# EAGLE design FTDI ESP Programmer V1.0 (EAGLE 9.5.0)
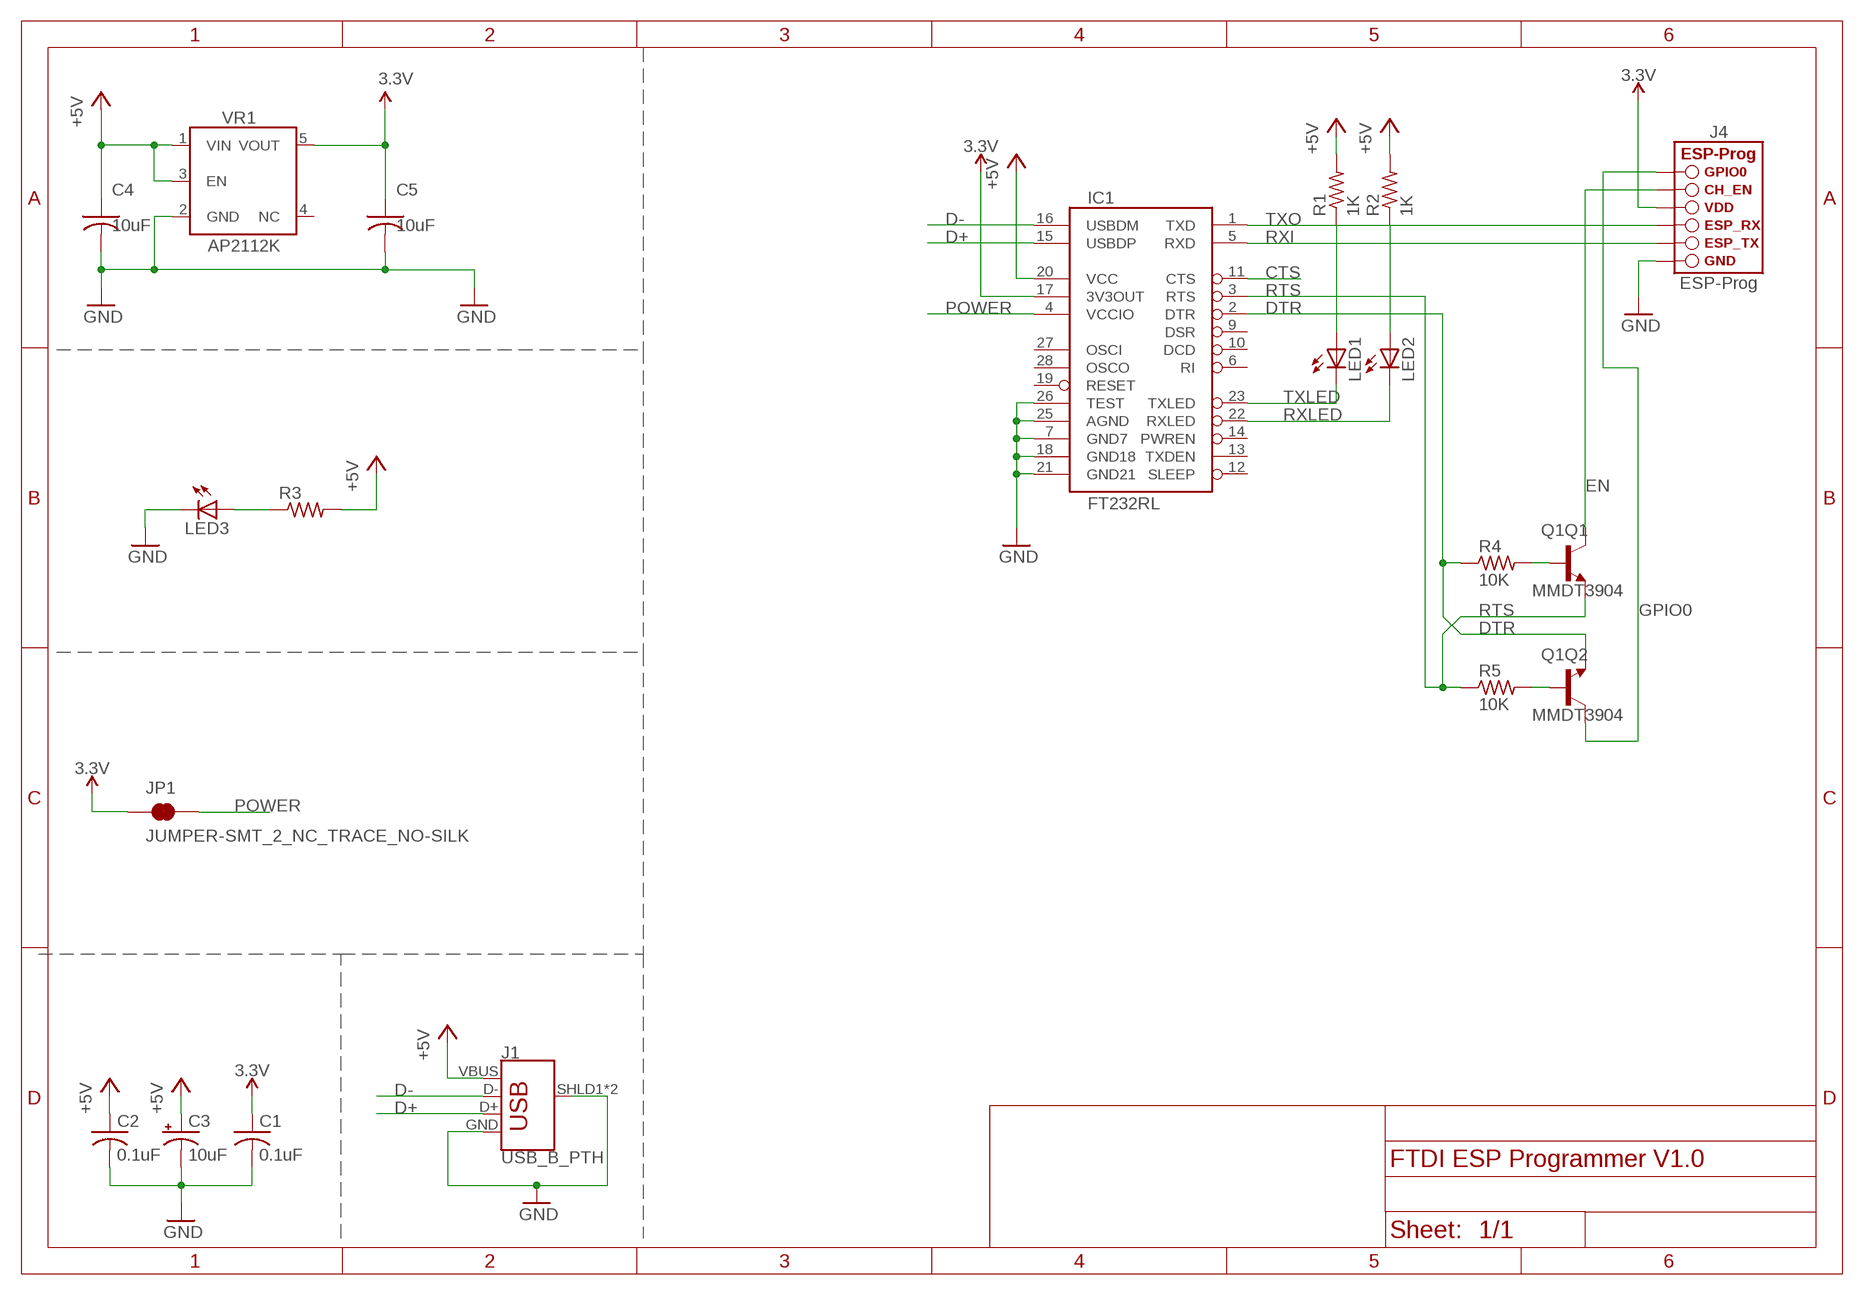
[diagram p0: schematic, sheet 1]

## Parts
C1  0.1uF  C-USC0603  [C0603]
C2  0.1uF  C-USC0603  [C0603]
C3  10uF  10UF-POLAR-EIA3216-16V-10%(TANT)  [EIA3216]
C4  10uF  C-USC0603  [C0603]
C5  10uF  C-USC0603  [C0603]
IC1  FT232RL  FT232RLSSOP  [SSOP28DB]
J1  USB_B_PTH  [USB-B-PTH]
J4  ESP-PROG-1X6-2.54-SOCKET-RA  [1X6-2.54-SOCKET-RA]
JP1  JUMPER-SMT_2_NC_TRACE_NO-SILK  [SMT-JUMPER_2_NC_TRACE_NO-SILK]
LED1  LEDCHIP-LED0805  [CHIP-LED0805]
LED2  LEDCHIP-LED0805  [CHIP-LED0805]
LED3  LEDCHIP-LED0805  [CHIP-LED0805]
Q1  MMDT3904  TRANS_NPN_DUAL-MMDT3904  [SOT-363]
R1  1K  R-US_R0603  [R0603]
R2  1K  R-US_R0603  [R0603]
R3  R-USR0603  [R0603@1]
R4  10K  R-USR0603  [R0603@1]
R5  10K  R-USR0603  [R0603@1]
VR1  AP2112KSOT25  [SOT23-5]

## Nets
3.3V: C1.1 C5.1 IC1.17(3V3OUT) J4.4(VDD) JP1.1 VR1.5(VOUT)
+5V: C2.1 C3.+ C4.1 IC1.20(VCC) J1.VBUS R1.2 R2.2 R3.2 VR1.1(VIN) VR1.3(EN)
CTS: IC1.11(CTS)
D+: IC1.15(USBDP) J1.D+
D-: IC1.16(USBDM) J1.D-
DTR: IC1.2(DTR) Q1.1(Q2:E) R4.1
EN: J4.5(CH_EN) Q1.3(Q1:C)
GND: C1.2 C2.2 C3.- C4.2 C5.2 IC1.7(GND7) IC1.18(GND18) IC1.21(GND21) IC1.25(AGND) IC1.26(TEST) J1.GND J1.SHLD1(SHIELD) J1.SHLD2(SHIELD) J4.1(GND) LED3.C VR1.2(GND)
GPIO0: J4.6(GPIO0) Q1.6(Q2:C)
N$1: LED1.A R1.1
N$2: LED3.A R3.1
N$4: LED2.A R2.1
N$7: Q1.5(Q1:B) R4.2
N$8: Q1.2(Q2:B) R5.2
POWER: IC1.4(VCCIO) JP1.2
RTS: IC1.3(RTS) Q1.4(Q1:E) R5.1
RXI: IC1.5(RXD) J4.2(ESP_TX)
RXLED: IC1.22(RXLED) LED2.C
TXLED: IC1.23(TXLED) LED1.C
TXO: IC1.1(TXD) J4.3(ESP_RX)
Unconnected: IC1.6(RI) IC1.9(DSR) IC1.10(DCD) IC1.12(SLEEP) IC1.13(TXDEN) IC1.14(PWREN) IC1.19(RESET) IC1.27(OSCI) IC1.28(OSCO) VR1.4(NC)

## Library data of the parts
C1 C2 C4 C5 = Dennistries-Josh:C-US: CAPACITOR, American symbol
C3 = Dennistries-Josh:10UF-POLAR: 3216 polarized capacitors A capacitor is a passive two-terminal electrical component used to store electrical energy temporarily in an electric field.; PROD_ID: CAP-00811
IC1 = Dennistries-Josh:FT232RL: FT232RL USB UART FT232RL 4th Generation USB UART (USB <-> Serial) Controller. Datasheet <http://www.sparkfun.com/datasheets/IC/FT232R_v104.pdf> SparkFun Products Component <https://www.sparkfun.com/products/650> (COM-00650) SparkFun RedBot Mainboard <https://www.sparkfun.com/products/12097> (ROB-12097) SparkFun FTDI Basic Breakout - 5V <https://www.sparkfun.com/products/9716> (DEV-09716) SparkFun FTDI Basic Breakout - 3.3V <https://www.sparkfun.com/products/9873> (DEV-09873) Bus Pirate - v3.6a <https://www.sparkfun.com/products/12942> (TOL-12942) SparkFun USB to Serial Breakout - FT232RL <https://www.sparkfun.com/products/12731> (BOB-12731) SparkFun PicoBoard <https://www.sparkfun.com/products/11888> (WIG-11888) SparkFun RFID USB Reader <https://www.sparkfun.com/products/9963> (SEN-09963) LilyPad FTDI Basic Breakout - 5V <https://www.sparkfun.com/products/10275> (DEV-10275) SparkFun Stepoko <https://www.sparkfun.com/products/13899> (ROB-13899); PROD_ID: IC-00870
J1 = Dennistries-Josh:USB_B: USB Type B Connector SparkFun Products: SparkFun Stepoko <https://www.sparkfun.com/products/13899> PTH; PROD_ID: CONN-08278; SF_ID: PRT-00139
J4 = Dennistries-Josh:ESP-PROG: ESP-Prog ESP-Prog programming header for ESP8266, ESP8285, and ESP32. Options for both 1x6 and 2x3 formats, in 2.54mm (0.1") and 1.27mm (0.05") pitch.
JP1 = Dennistries-Josh:JUMPER-SMT_2_NC_TRACE: Normally closed trace jumper This jumper has a trace between two pads so it's normally closed (NC). Use a razor knife to open the connection. For best results follow the IPC guidelines for cutting traces: Cutout at least 0.063 mm (0.005 in). Remove all loose material to clean up the cut area. Seal the cut with an approved epoxy. Reapply solder to reclose the connection.
LED1-LED3 = Dennistries-Josh:LED: LED OSRAM: - CHIPLED LG R971, LG N971, LY N971, LG Q971, LY Q971, LO R971, LY R971 LH N974, LH R974 LS Q976, LO Q976, LY Q976 LO Q996 - Hyper CHIPLED LW Q18S LB Q993, LB Q99A, LB R99A - SideLED LS A670, LO A670, LY A670, LG A670, LP A670 LB A673, LV A673, LT A673, LW A673 LH A674 LY A675 LS A676, LA A676, LO A676, LY A676, LW A676 LS A679, LY A679, LG A679 - Hyper Micro SIDELED® LS Y876, LA Y876, LO Y876, LY Y876 LT Y87S - SmartLED LW L88C, LW L88S LB L89C, LB L89S, LG L890 LS L89K, LO L89K, LY L89K LS L896, LA L896, LO L896, LY L896 - TOPLED LS T670, LO T670, LY T670, LG T670, LP T670 LSG T670, LSP T670, LSY T670, LOP T670, LYG T670 LG T671, LOG T671, LSG T671 LB T673, LV T673, LT T673, LW T673 LH T674 LS T676, LA T676, LO T676, LY T676, LB T676, LH T676, LSB T676, LW T676 LB T67C, LV T67C, LT T67C, LS T67K, LO T67K, LY T67K, LW E67C LS E67B, LA E67B, LO E67B, LY E67B, LB E67C, LV E67C, LT E67C LW T67C LS T679, LY T679, LG T679 LS T770, LO T770, LY T770, LG T770, LP T770 LB T773, LV T773, LT T773, LW T773 LH T774 LS E675, LA E675, LY E675, LS T675 LS T776, LA T776, LO T776, LY T776, LB T776 LHGB T686 LT T68C, LB T68C - Hyper Mini TOPLED® LB M676 - Mini TOPLED Santana® LG M470 LS M47K, LO M47K, LY M47K Source: http://www.osram.convergy.de/
Q1 = SuperHouse-DiscreteSemi:TRANS_NPN_DUAL: MMDT3904 Dual 3904 NPN transistors. Datasheet <http://www.onsemi.com/pub_link/Collateral/MBT3904DW1T1-D.PDF>; PROD_ID: TRANS-13337
R1 R2 = Dennistries-Josh:R-US_: RESISTOR, American symbol
R3-R5 = Dennistries-Josh:R-US: RESISTOR, American symbol
VR1 = Dennistries-Josh:AP2112K: AP2112K 3.3V linear voltage regulator

## Net classes
0 default: width 0.152 mm, drill 0.241 mm, clearance 0.152 mm

## Board
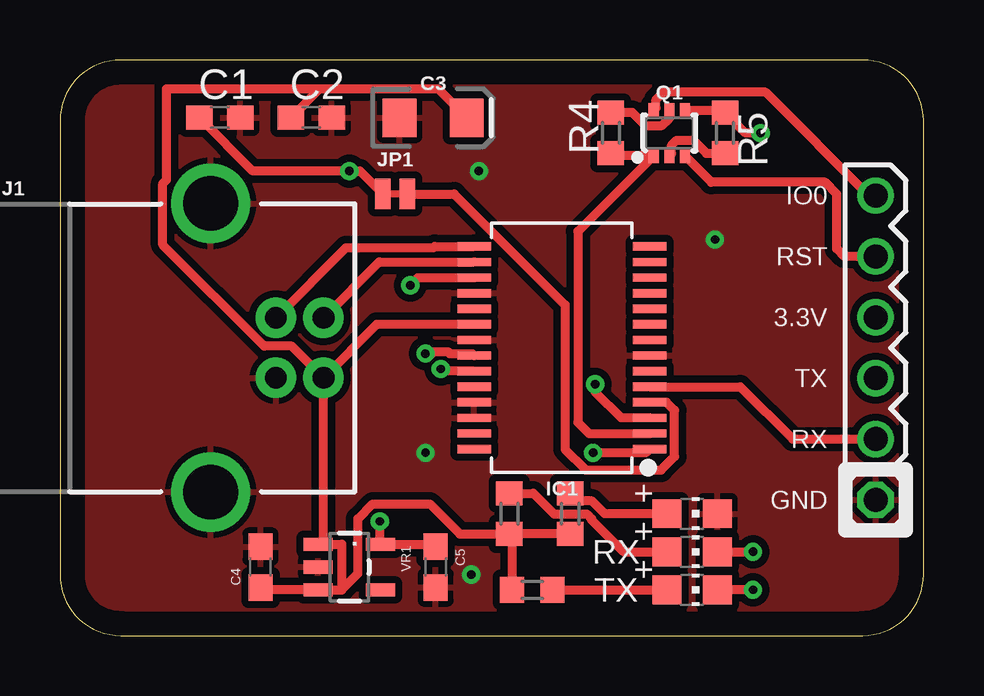
[diagram p1: board, top side]
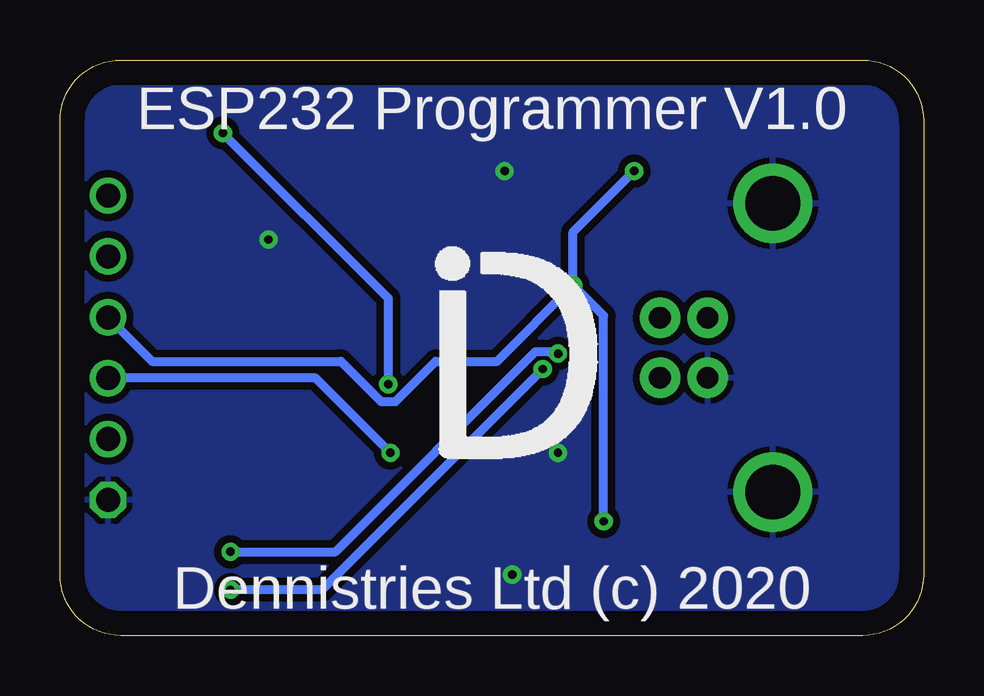
[diagram p2: board, bottom side, seen from below]

Size 36 x 24 mm. Coordinates in mm from the lower left corner, seen from the top.
Outline: 0,21.46 0,2.54 arc90 2.54,0 33.46,0 arc90 36,2.54 36,21.46 arc90 33.46,24 2.54,24 arc90 0,21.46
Copper layers (1*16): Top 0.035mm / dielectric 0.15mm / Bottom 0.035mm
Design rules "default": minimum track width 6mil, minimum drill 0.35mm, track to track 6mil, track to pad 6mil, pad to pad 6mil, via to via 6mil, smd to smd 6mil, copper to edge 40mil, drill to drill 6mil, minimum pad ring 10mil, minimum via ring 8mil, stop-mask expansion 4mil, vias tented up to drill 0mil, thermal gap 10mil

### Footprints (pad centres in the part's own frame; a part is rotated, then mirrored left to right if it is on the bottom)
C0603 = smd 1.1 x 1: 1 -0.85,0; 2 0.85,0
EIA3216 = smd 1.4 x 1.6: + 1.4,0; - -1.4,0
SSOP28DB = smd 0.348 x 1.397: 1 -4.225,-3.656; 2 -3.575,-3.656; 3 -2.925,-3.656; 4 -2.275,-3.656; 5 -1.625,-3.656; 6 -0.975,-3.656; 7 -0.325,-3.656; 8 0.325,-3.656; 9 0.975,-3.656; 10 1.625,-3.656; 11 2.275,-3.656; 12 2.925,-3.656; 13 3.575,-3.656; 14 4.225,-3.656; 15 4.225,3.656; 16 3.575,3.656; 17 2.925,3.656; 18 2.275,3.656; 19 1.625,3.656; 20 0.975,3.656; 21 0.325,3.656; 22 -0.325,3.656; 23 -0.975,3.656; 24 -1.625,3.656; 25 -2.275,3.656; 26 -2.925,3.656; 27 -3.575,3.656; 28 -4.225,3.656
USB-B-PTH = drill 0.914 pad 1.676: D+ 4,1.25; D- 5.981,1.25; GND 4,-1.25; VBUS 5.981,-1.25 | drill 2.286: SHLD1 1.282,-6.02; SHLD2 1.282,6.02
1X6-2.54-SOCKET-RA = drill 1 octagon: 1 -6.35,0 | drill 1: 2 -3.81,0; 3 -1.27,0; 4 1.27,0; 5 3.81,0; 6 6.35,0
SMT-JUMPER_2_NC_TRACE_NO-SILK = smd 0.635 x 1.27: 1 -0.508,0; 2 0.508,0
CHIP-LED0805 = smd 1.2 x 1.2: A 0,-1.05; C 0,1.05
SOT-363 = smd 0.42 x 0.6: 1 -0.65,-0.95; 2 0,-0.95; 3 0.65,-0.95; 4 0.65,0.95; 5 0,0.95; 6 -0.65,0.95
R0603 = smd 1 x 1.1: 1 -0.85,0; 2 0.85,0
R0603@1 = smd 1 x 1.1: 1 -0.85,0; 2 0.85,0
SOT23-5 = smd 0.55 x 1.2: 1 -0.95,-1.3; 2 0,-1.3; 3 0.95,-1.3; 4 0.95,1.3; 5 -0.95,1.3

### Placement (x,y rotation side)
C1  6.67,21.59 0 top
C2  10.48,21.59 0 top
C3  15.56,21.59 0 top
C4  8.36,2.86 90 top
C5  15.66,2.86 270 top
IC1  20.92,12 90 top
J1  5,12 0 top
J4  34,12 90 top
JP1  13.97,18.41 0 top
LED1  26.35,1.91 270 top
LED2  26.35,3.49 270 top
LED3  26.35,5.08 270 top
Q1  25.4,20.95 0 top
R1  19.68,1.91 180 top
R2  18.73,5.08 270 top
R3  21.27,5.08 270 top
R4  22.96,20.95 90 top
R5  27.73,20.95 270 top
VR1  12.06,2.86 270 top

### Tracks (layer width: path | path; a pad name or v marks a point on that pad's centre or on a via)
3.3V  (via drill 0.35)
  Top 0.381: JP1.1 12.51,19.37 v12.06,19.37 8.04,19.37 C1.1 | v14.61,14.61 14.93,14.93 IC1.17 | C5.1 15.56,3.81 VR1.5 13.34,3.84 v13.34,4.76
  Bottom 0.381: J4.4 32.16,11.43 24.28,11.43 22.61,9.76 22.01,9.76 20.34,11.43 17.78,11.43 v14.61,14.61 | v13.34,4.76 13.34,13.34 v14.61,14.61 | v14.61,14.61 14.61,16.83 v12.06,19.37
+5V
  Top 0.381: C2.1 10.83,22.79 | C3.+ 15.75,22.79 10.83,22.79 | IC1.20 13.21,12.97 J1.VBUS | J1.VBUS 9.66,12.07 8.51,12.07 4.29,16.29 4.29,18.85 4.45,19 4.45,22.79 10.83,22.79 | R3.2 R2.2 | R2.2 18.84,4.13 R1.2 | C4.1 8.46,1.91 VR1.3 11.74,1.91 | 11.74,1.91 11.75,1.91 | 11.75,1.91 11.75,3.81 11.74,3.81 VR1.1 10.98,4.02 J1.VBUS | 11.75,1.91 11.74,1.91 | R2.2 16.67,4.23 15.42,5.48 13.04,5.48 12.42,4.87 12.42,2.58 11.75,1.91
D+
  Top 0.381: IC1.15 15.63,16.23 15.57,16.17 11.92,16.17 J1.D+
D-
  Top 0.381: J1.D- 13.31,15.57 IC1.16
DTR
  Top 0.381: R4.1 23.06,20 Q1.1 21.59,16.84 21.59,8.89 22.05,8.43 IC1.2
EN
  Top 0.381: J4.5 32.7,15.81 32.38,16.13 32.38,18.41 31.9,18.9 27.16,18.9 Q1.3
GND  (via drill 0.35)
  other vias: 17.14,2.54 15.24,7.62 27.3,16.51 17.46,19.37
  pour Top (isolate 0.305): 0,0 36.83,0 36.83,24.13 0,24.13
  pour Bottom (isolate 0.305): 0,0 36.83,0 36.83,24.13 0,24.13
GPIO0
  Top 0.381: Q1.6 24.85,22 24.85,22.35 25.15,22.65 29.42,22.65 33.72,18.35 J4.6
N$1
  Top 0.381: R1.1 LED1.A
N$2
  Top 0.381: R3.1 21.6,5.61 22.18,5.61 22.71,5.08 LED3.A
N$4
  Top 0.381: R2.1 19.74,5.93 20.59,5.07 21.96,5.07 22.16,4.87 22.16,4.82 23.5,3.49 LED2.A
N$7
  Top 0.381: R4.2 23.86,21.8 24.4,21.26 25.1,21.26 25.4,21.56 Q1.5
N$8
  Top 0.381: Q1.2 25.5,20.1 25.5,20.45 25.7,20.65 26.4,20.65 26.95,20.11 R5.2
POWER
  Top 0.381: IC1.4 25.28,9.72 25.62,9.39 25.62,7.46 25.06,6.9 21.93,6.9 21.06,7.77 21.06,13.79 16.43,18.41 JP1.2
RTS  (via drill 0.35)
  Top 0.381: Q1.4 27.62,21.91 R5.1 28.57,20.95 v29.21,20.95 | IC1.3 23.4,9.07 22.31,10.16 v22.31,10.48
  Bottom 0.381: v22.31,10.48 22.31,14.06 v29.21,20.95
RXI
  Top 0.381: IC1.5 28.36,10.38 30.55,8.19 J4.2
RXLED  (via drill 0.35)
  Top 0.381: 27.4,3.37 LED2.C v28.89,3.49 | IC1.22 17.18,11.76 16.25,11.76 16.17,11.83 15.58,11.83 15.5,11.76 v15.23,11.76
  Bottom 0.381: v15.23,11.76 15.5,11.76 15.58,11.83 16.17,11.83 24.52,3.49 v28.89,3.49
TXLED  (via drill 0.35)
  Top 0.381: IC1.23 15.96,11.03 v15.88,11.11 | v28.89,1.91 LED1.C
  Bottom 0.381: v15.88,11.11 25.08,1.91 v28.89,1.91
TXO  (via drill 0.35)
  Top 0.381: IC1.1 24.42,7.62 v22.23,7.62
  Bottom 0.381: v22.23,7.62 25.34,10.73 J4.3

### Text on the board
tPlace: IO0 | RST | 3.3V | TX | RX | GND | RX | TX
bPlace: ESP232 Programmer V1.0 | Dennistries Ltd (c) 2020